# Altium schematic sheet [07] - TK2560_RTC.SchDoc
size A4; SheetNumber: 8; SheetTotal: 15
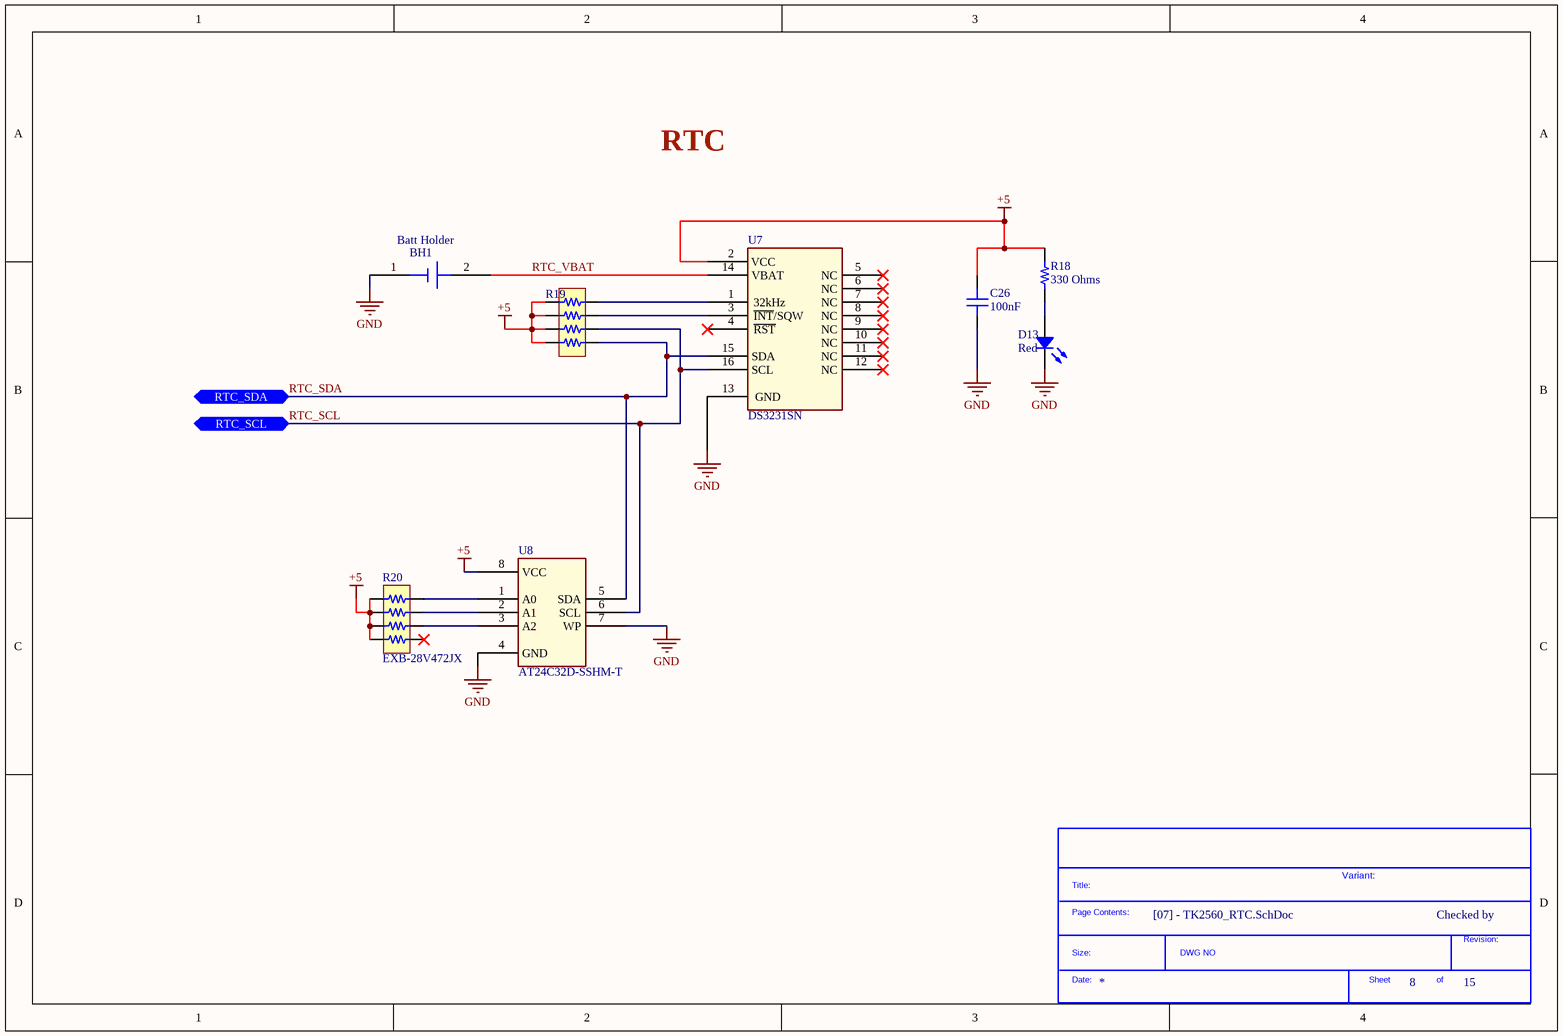
[diagram p0: [07] - TK2560_RTC.SchDoc]

## Parts
*?  SDTitleBlock  (value not drawn)  (graphical)
BH1  Batt Holder  [Batt Holder]
C26  100nF  [CAP 0805_2012]
D13  Red  [LED 1206_3216 RED]
R18  330 Ohms  [RES 0805_2012]
R19  EXB-28V472JX  [RESNET 0804-8 CONVEX]  (value not drawn)
R20  EXB-28V472JX  [RESNET 0804-8 CONVEX]
U7  DS3231SN  [16 SO]
U8  AT24C32D-SSHM-T  [8-Pin TTSOP]

## Ports
RTC_SCL (bidir), RTC_SDA (bidir)

## Nets
+5: C26.2 R18.2 R19.5 R19.6 R19.7 R19.8 R20.5 R20.6 R20.7 R20.8 U7.2(VCC) U8.8(VCC)
GND: BH1.1 C26.1 D13.2 U7.13(GND) U8.4(GND) U8.7(WP)
RTC_SCL: R19.2 U7.16(SCL) U8.6(SCL) ; port RTC_SCL
RTC_SDA: R19.1 U7.15(SDA) U8.5(SDA) ; port RTC_SDA
RTC_VBAT: BH1.2 U7.14(VBAT)
NetD13_1: D13.1 R18.1
NetR19_3: R19.3 U7.3(~{INT}/SQW)
NetR19_4: R19.4 U7.1(32kHz)
NetR20_2: R20.2 U8.3(A2)
NetR20_3: R20.3 U8.2(A1)
NetR20_4: R20.4 U8.1(A0)

Not connected (* = marked no-connect by the designer): R20 1*; U7 4(~{RST})* 5(NC)* 6(NC)* 7(NC)* 8(NC)* 9(NC)* 10(NC)* 11(NC)* 12(NC)*

## Notes on the sheet
- RTC
- Variant:
- Checked by
- (in symbol SDTitleBlock) Title:; Page Contents:; Revision:; Size:; DWG NO; Date:; Sheet; of

## Library data of the parts
BH1 = Batt Holder: BATTERY HOLDER COIN 20MM PC PIN; Manufacturer: Memory Protection Devices; Manufacturer Part Number: BS-7; Number of Cells: 1; Supplier 1: Digi-Key; RoHS: No; Category: Batteries and Accessories; Stock 1: 55851; Pricing 1: 1=0.78000, 10=0.66000, 50=0.57880, 100=0.54570, 250=0.50236, 500=0.47176, 1000=0.44115, 2500=0.40290, 5000=0.37230 (USD); Mount: Through Hole,PCB; Min Operating Temperature: -55°C; Max Operating Temperature: 105°C; Package Quantity: 100; Termination: PC Pin; Diameter: 20mm; Lead Free: Lead Free; ComponentLink1URL: https://datasheet.ciiva.com/3/bs-7-datasheet-3824.pdf?src-supplier=Digi-Key; ComponentLink1Description: https://datasheet.ciiva.com/3/bs-7-datasheet-3824.pdf?src-supplier=Digi-Key; Supplier Part Number 1: BS-7-ND
C26 = AC0805KKX8R9BB104: CAP CER 0805 10% X8R 50V 100NF; Manufacturer: Yageo; Capacitance: 0.1µF; Part Number: AC0805KKX8R9BB104; Value: 100nF; Applications: Automotive; ComponentLink1Description: Datasheet; ComponentLink1URL: http://www.yageo.com/documents/recent/AC0805KKX8R9BB104.pdf; ComponentLink2Description: DigiKey Link; ComponentLink2URL: http://digikey.com/product-detail/en/yageo/AC0805KKX8R9BB104/311-4624-1-ND/9699550; Device Package: 0805 (2012 Metric); LastUpdated: 02/09/2020 01:04:20; Lifecycle Status: Active; Minimum Order: 1; Mounting Type: Surface Mount, MLCC; Operating Temperature: -55°C ~ 150°C; Package / Case: 0805 (2012 Metric); Packaging: TapeAndReel; PartId: 14076; Part Status: Active; Price: 0.06; Ratings: AEC-Q200; Series: AC; Size / Dimension: 0.079" L x 0.049" W (2.00mm x 1.25mm); Supplier 1: DigiKey; Supplier Part Number 1: 311-4624-1-ND; Temperature Coefficient: X8R; Thickness (Max): 0.057" (1.45mm); Tolerance: ±10%; Voltage - Rated: 50V
D13 = APTL3216SURCK-01: LED SMD; Manufacturer: Kingbright; Configuration: 1206; Current - Test: 20mA; Lens Color: Colorless; Lens Size: 1.10mm Dia; Lens Style: Round with Domed Top; Lens Transparency: Clear; Millicandela Rating: 230mcd; Viewing Angle: 80°; Voltage - Forward (Vf) (Typ): 1.95V; Wavelength - Dominant: 630nm; Wavelength - Peak: 645nm; Part Number: APTL3216SURCK-01; Color: Red; ComponentLink1Description: Datasheet; ComponentLink1URL: http://www.kingbrightusa.com/images/catalog/SPEC/APTL3216SURCK-01.pdf; ComponentLink2Description: DigiKey Link; ComponentLink2URL: http://digikey.com/product-detail/en/kingbright/APTL3216SURCK-01/754-APTL3216SURCK-01CT-ND/10293135; Device Package: 1206 (3216 Metric); Height (Max): 1.20mm; LastUpdated: 9/2/2020 01:21:09; Lifecycle Status: Active; Minimum Order: 1; Mounting Type: Surface Mount; Package / Case: 1206 (3216 Metric); Packaging: TapeAndReel; PartId: 229; Part Status: Active; Price: 0.08; Series: Heli-R; Size / Dimension: 3.20mm L x 1.60mm W; Supplier 1: DigiKey; Supplier Part Number 1: 754-APTL3216SURCK-01CT-ND; Supplier Device Package: 1206; Value: Red
R18 = ERJ-6GEYJ331V: RES SMD 330 OHM 5% 1/8W 0805; Manufacturer: Panasonic Electronic Components; Power (Watts): 0.125W, 1/8W; Temperature Coefficient: ±200ppm/°C; Part Number: ERJ-6GEYJ331V; Value: 330 Ohms; ComponentLink1Description: Datasheet; ComponentLink1URL: http://industrial.panasonic.com/www-cgi/jvcr13pz.cgi?E+PZ+3+AOA0001+ERJ6GEYJ331V+7+WW; ComponentLink2Description: DigiKey Link; ComponentLink2URL: http://digikey.com/product-detail/en/panasonic-electronic-components/ERJ-6GEYJ331V/P330ACT-ND/90025; Composition: Thick Film; Device Package: 0805 (2012 Metric); Features: Automotive AEC-Q200; Height - Seated (Max): 0.028" (0.70mm); LastUpdated: 02/09/2020 01:15:19; Lifecycle Status: Active; Minimum Order: 1; Number of Terminations: 2; Operating Temperature: -55°C ~ 155°C; Package / Case: 0805 (2012 Metric); Packaging: TapeAndReel; PartId: 30017; Part Status: Active; Price: 0.01; Ratings: AEC-Q200; Resistance: 330 Ohms; Series: ERJ; Size / Dimension: 0.079" L x 0.049" W (2.00mm x 1.25mm); Supplier 1: DigiKey; Supplier Part Number 1: P330ACT-ND; Supplier Device Package: 0805; Tolerance: ±5%
R19 R20 = EXB-28V472JX: RES ARRAY 4 RES 4.7K OHM 0804; Manufacturer: Panasonic Electronic Components; Circuit Type: Isolated; Number of Resistors: 4; Power Per Element: 62.5mW; Temperature Coefficient: ±200ppm/°C; Tolerance: ±5%; Part Number: EXB-28V472JX; Applications: Automotive AEC-Q200; ComponentLink1Description: Datasheet; ComponentLink1URL: https://industrial.panasonic.com/cdbs/www-data/pdf/AOC0000/AOC0000C14.pdf; ComponentLink2Description: DigiKey Link; ComponentLink2URL: http://digikey.com/product-detail/en/panasonic-electronic-components/EXB-28V472JX/Y7472CT-ND/256356; Height - Seated (Max): 0.018" (0.45mm); LastUpdated: 9/2/2020 01:23:28; Lifecycle Status: Active; Minimum Order: 1; Mounting Type: Surface Mount; Number of Pins: 8; Operating Temperature: -55°C ~ 125°C; Package / Case: 0804, Convex, Long Side Terminals; Packaging: TapeAndReel; PartId: 462; Part Status: Active; Price: 0.01; Resistance (Ohms): 4.7k; Series: EXB; Size / Dimension: 0.079" L x 0.039" W (2.00mm x 1.00mm); Supplier 1: DigiKey; Supplier Part Number 1: Y7472CT-ND; Supplier Device Package: 0804
U7 = DS3231SN: MAXIM INTEGRATED PRODUCTS - DS3231SN#T&R - IC, RTC, Datum-/Zeitformat (Tag/Datum/Monat/Jahr, hh:mm:ss), I2C, 2.3V-5.5V Versorgung, SOIC-16; Max Supply Voltage: 5.5V; Min Supply Voltage: 2.3V; Interface: I2C,Serial,2-Wire; Logic Function: Clock; Date Format: YY-MM-DD-dd; Operating Supply Voltage: 3.3V; Supplier 1: Digi-Key; Manufacturer: Maxim; Manufacturer Part Number: DS3231SN#T&R; RoHS: Yes; Category: Real Time Clocks; Stock 1: 4168; Pricing 1: 1=8.82000, 10=7.96700, 25=7.59600, 100=6.59560, 250=6.29920, 500=5.74336 (USD); Mount: Surface Mount; Case/Package: SOIC; Number of Pins: 16; Contact Plating: Tin,Matte; Min Operating Temperature: -40°C; Max Operating Temperature: 85°C; Packaging: Tape and Reel; Package Quantity: 1000; Time Format: HH:MM:SS; Series: -; Radiation Hardening: No; Lead Free: Lead Free; RoHS Compliant: Yes; ComponentLink1URL: https://datasheet.ciiva.com/17307/ds3231-17307128.pdf?src-supplier=Avnet+Europe; ComponentLink1Description: https://datasheet.ciiva.com/17307/ds3231-17307128.pdf?src-supplier=Avnet+Europe; ComponentLink2URL: https://datasheet.ciiva.com/12291/ds3231-102175-12291260.pdf?src-supplier=Mouser; ComponentLink2Description: https://datasheet.ciiva.com/12291/ds3231-102175-12291260.pdf?src-supplier=Mouser; ComponentLink3URL: https://datasheet.ciiva.com/14244/ds3231-14244637.pdf?src-supplier=Avnet; ComponentLink3Description: https://datasheet.ciiva.com/14244/ds3231-14244637.pdf?src-supplier=Avnet; ComponentLink4URL: https://datasheet.ciiva.com/14244/ds3231-14244733.pdf?src-supplier=Avnet; ComponentLink4Description: https://datasheet.ciiva.com/14244/ds3231-14244733.pdf?src-supplier=Avnet; Supplier Part Number 1: DS3231SN#T&RCT-ND
U8 = AT24C32D-SSHM-T: EEPROM Serial-2Wire 32K-bit 4K x 8 1.8V/2.5V/3.3V/5V 8-Pin SOIC T/R; Manufacturer: Microchip / Atmel; Min Supply Voltage: 1.7V; Max Supply Voltage: 5.5V; Access Time: 550ns; Density: 32Kb; Frequency: 1MHz; Nominal Supply Current: 3mA; Interface: I2C,Serial,2-Wire; Operating Supply Voltage: 5V; Organization: 4KX8; Write Protection: YES; Write Cycle Time-Max (tWC): 5ms; Manufacturer Part Number: AT24C32D-SSHM-T; RoHS: Yes; Category: EEPROM; Pricing 1: 1=0.44000 (USD); Mount: Surface Mount; Case/Package: SOIC; Number of Pins: 8; Min Operating Temperature: -40°C; Max Operating Temperature: 85°C; Packaging: Tape and Reel; Package Quantity: 1; Memory Type: EEPROM; Memory Size: 32Kb; Max Frequency: 1MHz; Voltage: 5V; Series: -; Access Time-Max: 550ns; Supply Current: 3mA; Supply Voltage-Nom: 5.5V; Radiation Hardening: No; REACH SVHC: No SVHC; Lead Free: Lead Free; RoHS Compliant: Yes; ComponentLink1URL: https://datasheet.ciiva.com/15123/getdatasheetpartid-320868-15123383.pdf?src-supplier=Verical; ComponentLink1Description: https://datasheet.ciiva.com/15123/getdatasheetpartid-320868-15123383.pdf?src-supplier=Verical; ComponentLink2URL: https://datasheet.ciiva.com/5700/1744693-5700966.pdf?src-supplier=Farnell; ComponentLink2Description: https://datasheet.ciiva.com/5700/1744693-5700966.pdf?src-supplier=Farnell; ComponentLink3URL: https://datasheet.ciiva.com/26869/at24c32d-sshm-t-26869756.pdf?src-supplier=IIIC; ComponentLink3Description: https://datasheet.ciiva.com/26869/at24c32d-sshm-t-26869756.pdf?src-supplier=IIIC; ComponentLink4URL: https://datasheet.ciiva.com/6615/atmel-8866-seeprom-at24c32d-datasheet-6615162.pdf?src-supplier=Digi-Key; ComponentLink4Description: https://datasheet.ciiva.com/6615/atmel-8866-seeprom-at24c32d-datasheet-6615162.pdf?src-supplier=Digi-Key; ComponentLink5URL: https://datasheet.ciiva.com/24168/atmel-8850-seeprom-at24c64d-datasheet-24168478.pdf?src-supplier=Future+Electronics; ComponentLink5Description: https://datasheet.ciiva.com/24168/atmel-8850-seeprom-at24c64d-datasheet-24168478.pdf?src-supplier=Future+Electronics; ComponentLink6URL: https://datasheet.ciiva.com/18617/atmel-8866-seeprom-at24c32d-datasheet-18617722.pdf?src-supplier=Digi-Key; ComponentLink6Description: https://datasheet.ciiva.com/18617/atmel-8866-seeprom-at24c32d-datasheet-18617722.pdf?src-supplier=Digi-Key; ComponentLink7URL: https://datasheet.ciiva.com/6615/atmel-8866-seeprom-at24c32d-datasheet-6615163.pdf?src-supplier=Digi-Key; ComponentLink7Description: https://datasheet.ciiva.com/6615/atmel-8866-seeprom-at24c32d-datasheet-6615163.pdf?src-supplier=Digi-Key; ComponentLink8URL: https://datasheet.ciiva.com/22729/1744693-22729500.pdf?src-supplier=Element14; ComponentLink8Description: https://datasheet.ciiva.com/22729/1744693-22729500.pdf?src-supplier=Element14; ComponentLink9URL: https://datasheet.ciiva.com/22618/1744693-22618573.pdf?src-supplier=Element14; ComponentLink9Description: https://datasheet.ciiva.com/22618/1744693-22618573.pdf?src-supplier=Element14; Supplier Part Number 1: AT24C32D-SSHM-TCT-ND